# Altium schematic sheet XKT3619_wireless_charging_driver_R.SchDoc
size A4
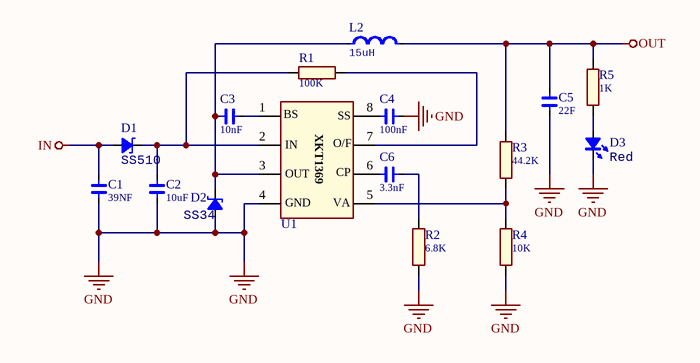
[diagram p0: XKT3619_wireless_charging_driver_R.SchDoc]

## Parts
C1  value 39NF  [CAP_1206]  (hidden comment: Cap)
C2  value 10uF  [CAP_1206]  (hidden comment: Cap)
C3  value 10nF  [CAP_0603]  (hidden comment: Cap)
C4  value 100nF  [CAP_0603]  (hidden comment: Cap)
C5  value 22F  [CAP_1206]  (hidden comment: Cap)
C6  value 3.3nF  [CAP_0603]  (hidden comment: Cap)
D1  SS510  [DO-214AB]
D2  SS34  [DO-214AC]
D3  Red  [LED_0805]
L2  value 15uH  [IND_CD75]  (hidden comment: Ind)
R1  value 100K  [RES_0603]  (hidden comment: Res)
R2  value 6.8K  [RES_0603]  (hidden comment: Res)
R3  value 44.2K  [RES_0603]  (hidden comment: Res)
R4  value 10K  [RES_0603]  (hidden comment: Res)
R5  value 1K  [RES_0805]  (hidden comment: Res)
U1  XLT-3169  [SOP8_M]  (value not drawn)

## Nets
GND: C1.1 C2.1 C4.2 C5.1 D2.1(A) D3.2(K) R2.1 R4.1 U1.4(GND)
IN: C1.2 D1.1(A)
OUT: C5.2 L2.2 R3.2 R5.2
NetC2_2: C2.2 D1.2(K) R1.1 U1.2(IN)
NetC3_1: C3.1 D2.2(K) L2.1 U1.3(OUT)
NetC3_2: C3.2 U1.1(BS)
NetC4_1: C4.1 U1.8(SS)
NetC6_1: C6.1 U1.6(CP)
NetC6_2: C6.2 R2.2
NetD3_1: D3.1(A) R5.1
NetR1_2: R1.2 U1.7(O/F)
NetR3_1: R3.1 R4.2 U1.5(VA)

## Notes on the sheet
- (in symbol XLT-3169) XKT1369

## Library data of the parts
D1 D2 = SchottkyDiode: Schottky Diode
  D1: Value: SS510
  D2: Value: SS34
D3 = LED: Value: Red
L2 = Ind: Inductor; Specification: ±5% 100mA; Manufacturer: *
U1 = XLT-3169: XKT-3169 是芯科泰无线充电系列通用接收集成电路，体积小输出功率大，可配合各种无线充电方案应用，电路简单使用方便